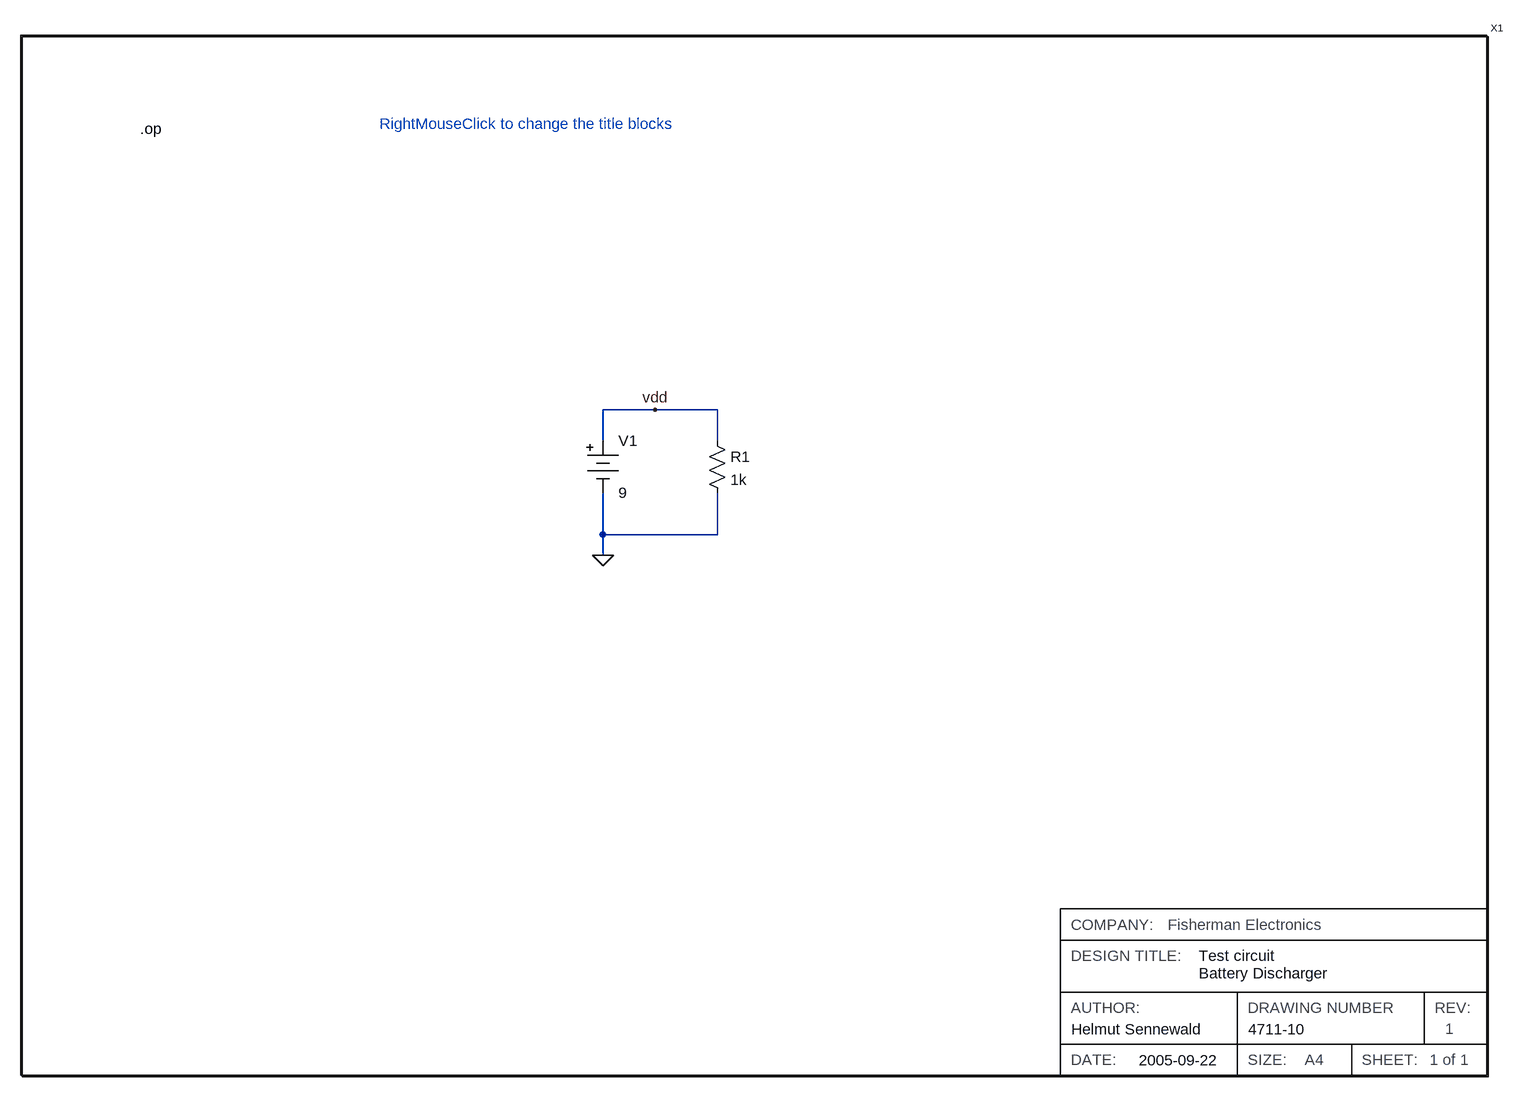
[diagram p0: schematic example_master_a4_ls.asc]
example_master_a4_ls.asc, the LTspice schematic file:
Version 4
SHEET 1 4676 1732
WIRE 1344 688 1344 640
WIRE 1344 832 1344 768
WIRE 1344 864 1344 832
WIRE 1424 640 1344 640
WIRE 1520 640 1424 640
WIRE 1520 688 1520 640
WIRE 1520 832 1344 832
WIRE 1520 832 1520 768
FLAG 1344 864 0
FLAG 1424 640 vdd
SYMBOL res 1504 672 R0
SYMATTR InstName R1
SYMATTR Value 1k
SYMBOL master_frame_a4_ls 448 64 R0
SYMATTR Value Helmut Sennewald
SYMATTR Value2 4711-10
SYMATTR SpiceLine Test circuit
SYMATTR SpiceLine2 Battery Discharger
SYMATTR SpiceModel 2005-09-22
SYMATTR InstName X1
SYMBOL Misc\\battery 1344 672 R0
SYMATTR InstName V1
SYMATTR Value 9
TEXT 632 208 Left 0 !.op
TEXT 1000 200 Left 0 ;RightMouseClick to change the title blocks

The netlist it stands for:
* example_master_a4_ls.asc
R1 vdd 0 1k
XX1 2005-09-22 Helmut Sennewald 4711-10 Test circuit Battery Discharger
V1 vdd 0 9
.op
* RightMouseClick to change the title blocks
.backanno
.end